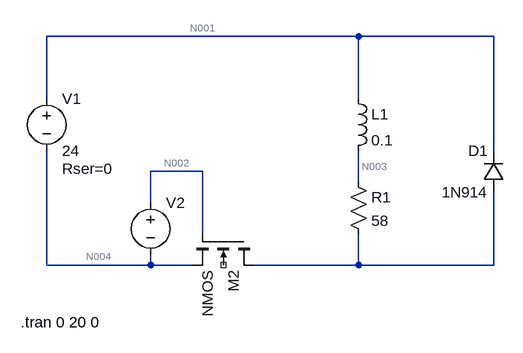
[diagram p0: schematic Solenoid circuit.asc]
Solenoid circuit.asc, the LTspice schematic file:
Version 4.1
SHEET 1 1320 680
WIRE 736 -80 256 -80
WIRE 944 -80 736 -80
WIRE 256 16 256 -80
WIRE 736 16 736 -80
WIRE 944 96 944 -80
WIRE 496 128 416 128
WIRE 736 144 736 96
WIRE 416 176 416 128
WIRE 496 224 496 128
WIRE 256 272 256 96
WIRE 416 272 416 256
WIRE 416 272 256 272
WIRE 480 272 416 272
WIRE 736 272 736 224
WIRE 736 272 576 272
WIRE 944 272 944 160
WIRE 944 272 736 272
SYMBOL voltage 416 160 R0
WINDOW 3 24 96 Invisible 2
WINDOW 123 0 0 Left 0
WINDOW 39 0 0 Left 0
SYMATTR InstName V2
SYMATTR Value PULSE(0 12000 0 0.005 0.005 5 10 2)
SYMBOL voltage 256 0 R0
WINDOW 123 0 0 Left 0
WINDOW 39 24 124 Left 2
SYMATTR InstName V1
SYMATTR Value 24
SYMATTR SpiceLine Rser=0
SYMBOL res 720 128 R0
SYMATTR InstName R1
SYMATTR Value 58
SYMATTR SpiceLine pwr=24
SYMBOL nmos4 576 224 R90
SYMATTR InstName M2
SYMBOL ind 720 0 R0
SYMATTR InstName L1
SYMATTR Value 0.1
SYMATTR SpiceLine Rser=1m
SYMBOL diode 960 160 R180
WINDOW 0 24 64 Left 2
WINDOW 3 24 0 Left 2
SYMATTR InstName D1
SYMATTR Value 1N914
TEXT 216 360 Left 2 !.tran 0 20 0

The netlist it stands for:
* Solenoid circuit.asc
V2 N002 N004 PULSE(0 12000 0 0.005 0.005 5 10 2)
V1 N001 N004 24 Rser=0
R1 N003 N005 58 pwr=24
M2 N005 N002 N004 NC_01 NMOS
L1 N001 N003 0.1 Rser=1m
D1 N005 N001 1N914
.model D D
.lib standard.dio
.model NMOS NMOS
.model PMOS PMOS
.lib standard.mos
.tran 0 20 0
.backanno
.end

* Results of the author's LTspice run, read from the files saved beside the schematic
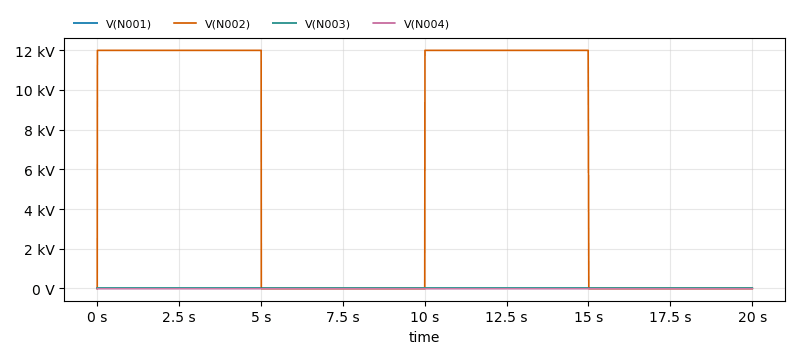
[diagram p1: Transient Analysis of Solenoid circuit.asc, plotted from the saved traces]
* Transient Analysis, 1 run:
*   V(N001): min 5.934 V, max 21.06 V, average 11.9 V, rms 11.9 V, last 11.89 V
*   V(N002): min -18.07 V, max 11.99 kV, average 5.994 kV, rms 8.48 kV, last -12.11 V
*   V(N003): min 2.767 V, max 17.85 V, average 11.9 V, rms 11.9 V, last 11.89 V
*   V(N004): min -18.07 V, max -2.941 V, average -12.1 V, rms 12.1 V, last -12.11 V